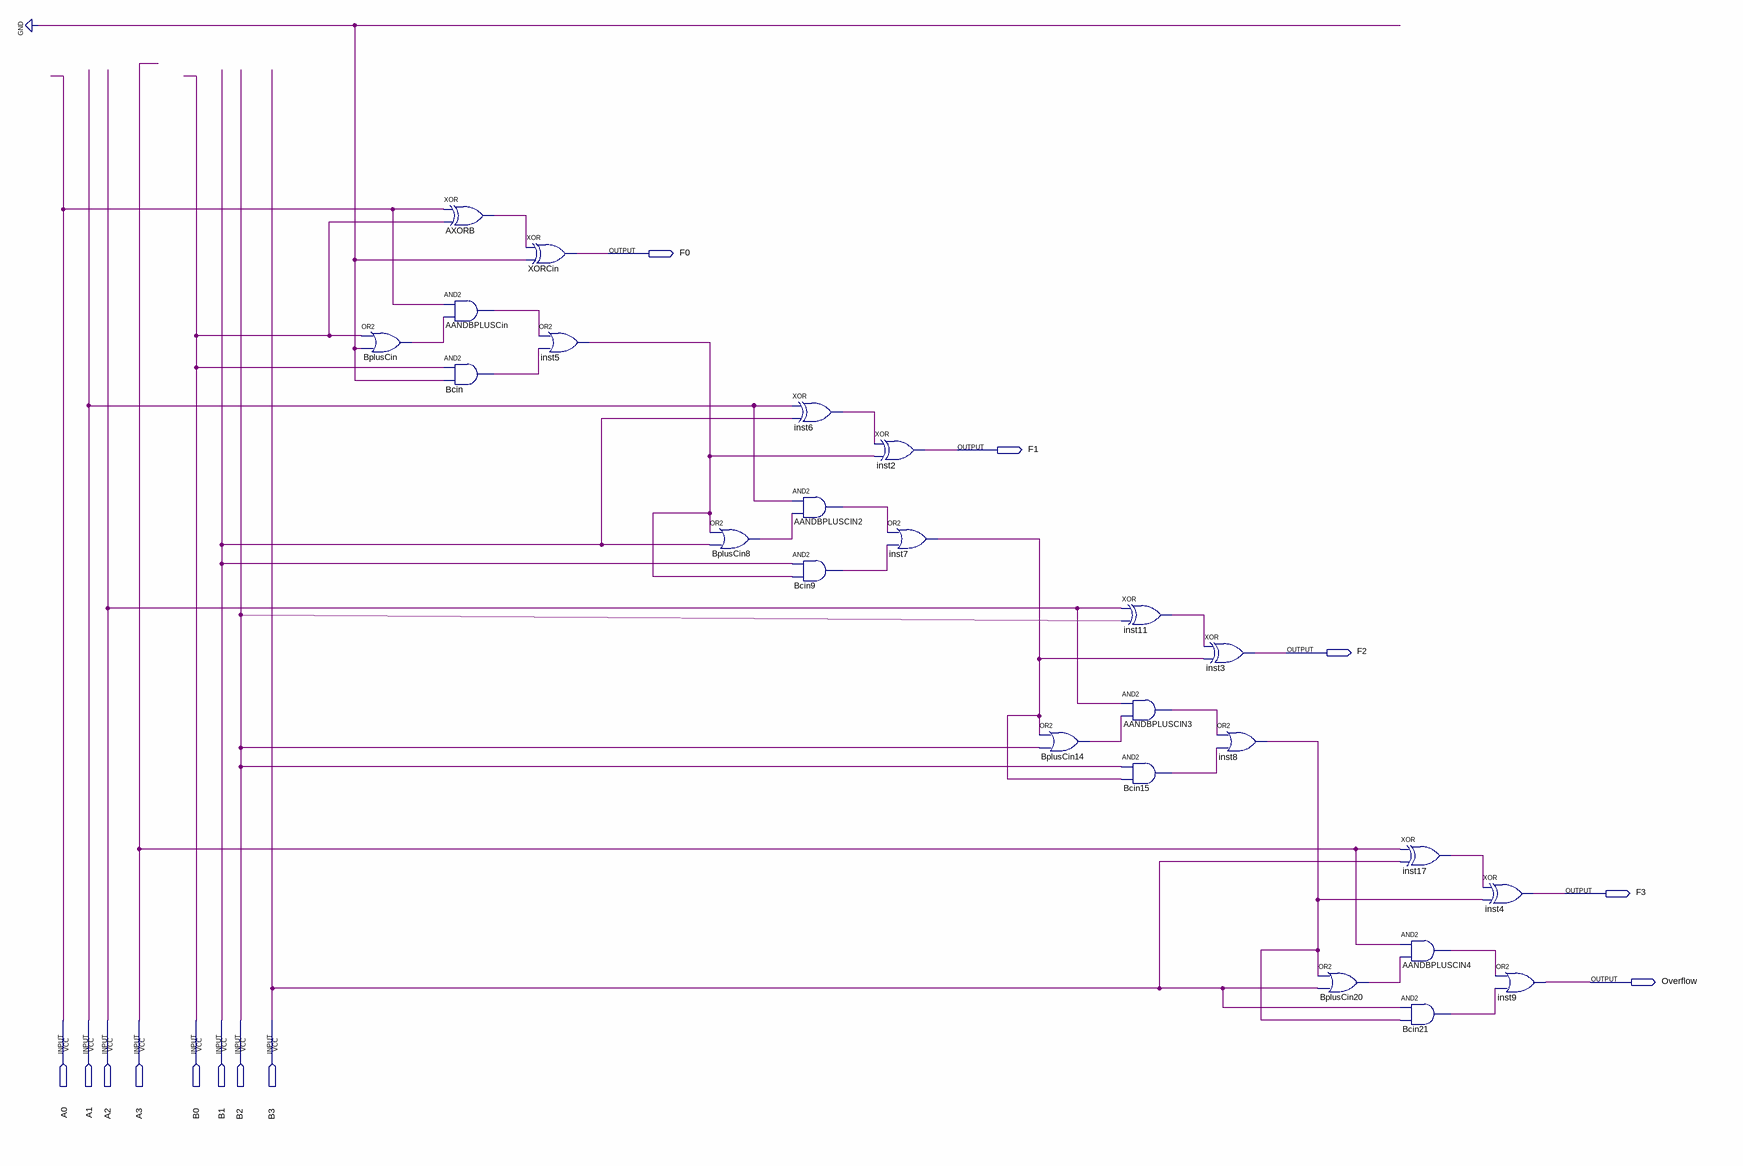
[diagram p0: schematic sheet]
// Quartus schematic projeto4lab.bdf as structural Verilog: 24 symbols, 13 pins
module projeto4lab (
  input  A0,
  input  A1,
  input  A2,
  input  A3,
  input  B0,
  input  B1,
  input  B2,
  input  B3,
  output F0,
  output F1,
  output F2,
  output F3,
  output Overflow
);

  wire AANDBPLUSCIN2_out, AANDBPLUSCIN3_out, AANDBPLUSCIN4_out, AANDBPLUSCin_out, AXORB_out, Bcin9_out,
       Bcin15_out, Bcin21_out, Bcin_out, BplusCin8_out, BplusCin14_out, BplusCin20_out, BplusCin_out,
       inst5_out, inst6_out, inst7_out, inst8_out, inst11_out, inst17_out;

  or BplusCin (BplusCin_out, B0, 1'b0);
  xor AXORB (AXORB_out, A0, B0);
  and AANDBPLUSCin (AANDBPLUSCin_out, A0, BplusCin_out);
  and Bcin (Bcin_out, B0, 1'b0);
  xor XORCin (F0, AXORB_out, 1'b0);
  or inst5 (inst5_out, AANDBPLUSCin_out, Bcin_out);
  or BplusCin8 (BplusCin8_out, inst5_out, B1);
  xor inst6 (inst6_out, A1, B1);
  and AANDBPLUSCIN2 (AANDBPLUSCIN2_out, A1, BplusCin8_out);
  and Bcin9 (Bcin9_out, B1, inst5_out);
  xor inst2 (F1, inst6_out, inst5_out);
  or inst7 (inst7_out, AANDBPLUSCIN2_out, Bcin9_out);
  or BplusCin14 (BplusCin14_out, inst7_out, B2);
  xor inst11 (inst11_out, A2, B2);
  and AANDBPLUSCIN3 (AANDBPLUSCIN3_out, A2, BplusCin14_out);
  and Bcin15 (Bcin15_out, B2, inst7_out);
  xor inst3 (F2, inst11_out, inst7_out);
  or inst8 (inst8_out, AANDBPLUSCIN3_out, Bcin15_out);
  or BplusCin20 (BplusCin20_out, inst8_out, B3);
  xor inst17 (inst17_out, A3, B3);
  and AANDBPLUSCIN4 (AANDBPLUSCIN4_out, A3, BplusCin20_out);
  and Bcin21 (Bcin21_out, B3, inst8_out);
  xor inst4 (F3, inst17_out, inst8_out);
  or inst9 (Overflow, AANDBPLUSCIN4_out, Bcin21_out);
endmodule
